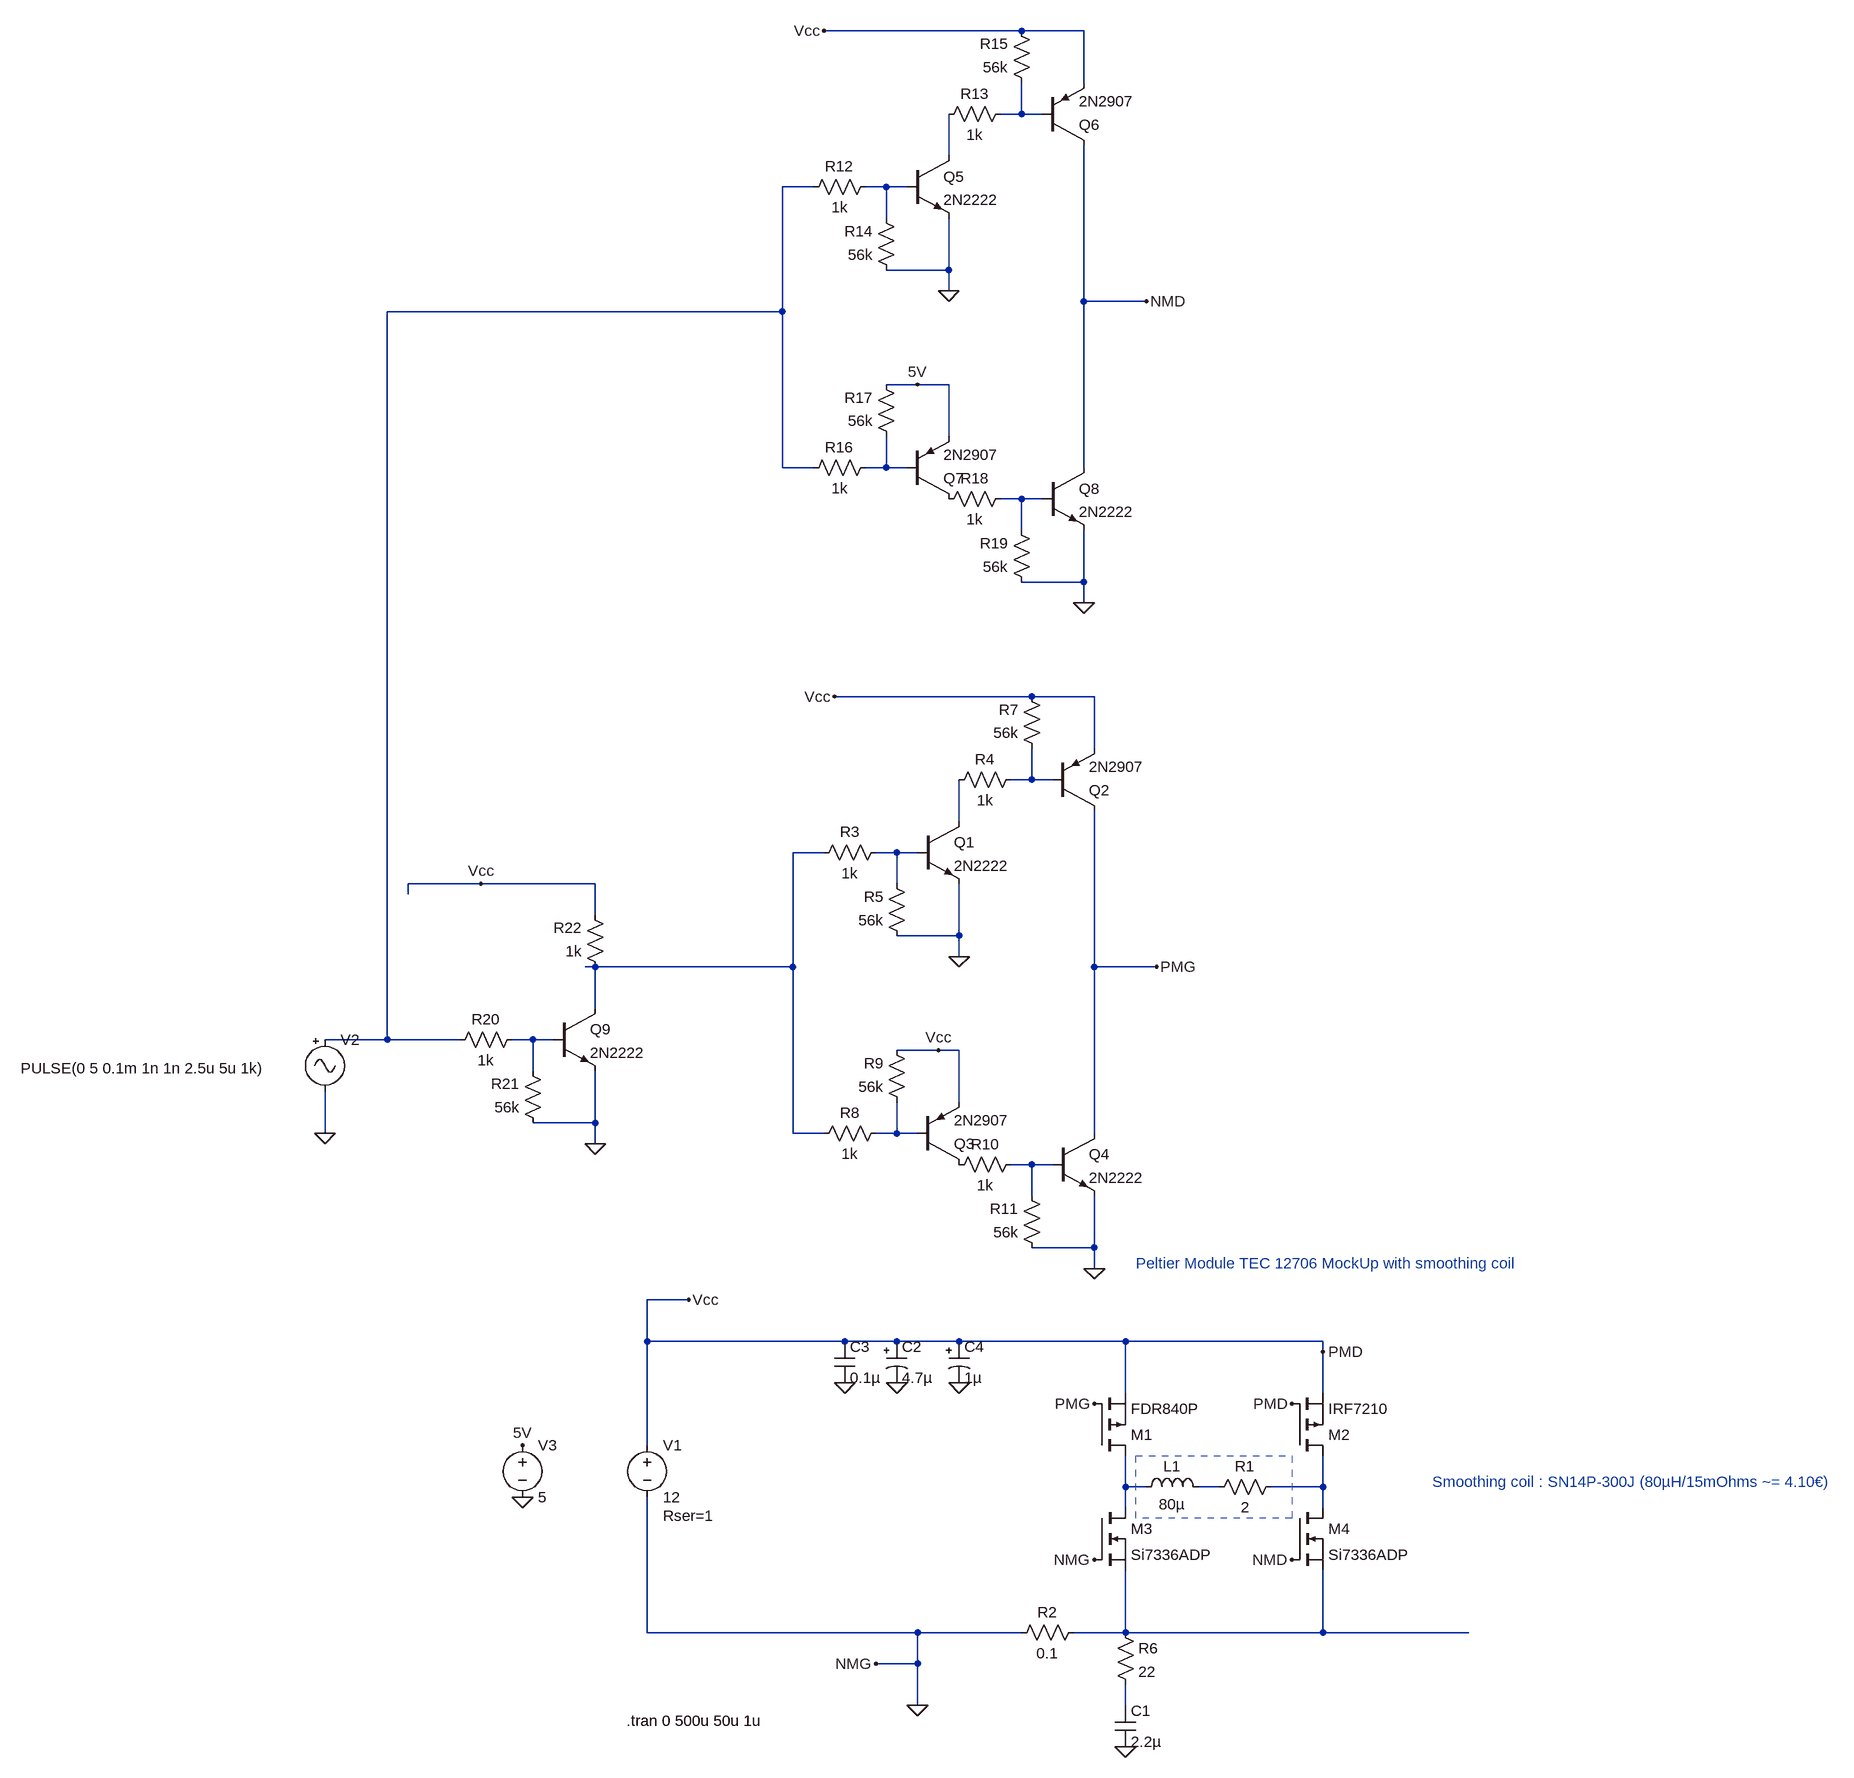
[diagram p0: schematic HBridge_SmoothPeltierModules.asc]
HBridge_SmoothPeltierModules.asc, the LTspice schematic file:
Version 4
SHEET 1 1244 680
WIRE -64 -2032 -368 -2032
WIRE 32 -2032 -64 -2032
WIRE 32 -1952 32 -2032
WIRE -64 -1904 -64 -1952
WIRE -64 -1904 -96 -1904
WIRE -32 -1904 -64 -1904
WIRE -176 -1840 -176 -1904
WIRE -384 -1792 -432 -1792
WIRE -272 -1792 -304 -1792
WIRE -240 -1792 -272 -1792
WIRE -272 -1744 -272 -1792
WIRE -176 -1664 -176 -1744
WIRE -176 -1664 -272 -1664
WIRE -176 -1632 -176 -1664
WIRE 32 -1616 32 -1856
WIRE 128 -1616 32 -1616
WIRE -432 -1600 -432 -1792
WIRE -432 -1600 -1040 -1600
WIRE -224 -1488 -272 -1488
WIRE -176 -1488 -224 -1488
WIRE -176 -1408 -176 -1488
WIRE -432 -1360 -432 -1600
WIRE -384 -1360 -432 -1360
WIRE -272 -1360 -272 -1408
WIRE -272 -1360 -304 -1360
WIRE -240 -1360 -272 -1360
WIRE 32 -1360 32 -1616
WIRE -64 -1312 -96 -1312
WIRE -32 -1312 -64 -1312
WIRE -64 -1264 -64 -1312
WIRE 32 -1184 32 -1264
WIRE 32 -1184 -64 -1184
WIRE 32 -1152 32 -1184
WIRE -48 -1008 -352 -1008
WIRE 48 -1008 -48 -1008
WIRE 48 -928 48 -1008
WIRE -48 -880 -48 -928
WIRE -48 -880 -80 -880
WIRE -16 -880 -48 -880
WIRE -160 -816 -160 -880
WIRE -368 -768 -416 -768
WIRE -256 -768 -288 -768
WIRE -224 -768 -256 -768
WIRE -896 -720 -1008 -720
WIRE -720 -720 -896 -720
WIRE -256 -720 -256 -768
WIRE -1008 -704 -1008 -720
WIRE -720 -672 -720 -720
WIRE -160 -640 -160 -720
WIRE -160 -640 -256 -640
WIRE -160 -608 -160 -640
WIRE -720 -592 -736 -592
WIRE -416 -592 -416 -768
WIRE -416 -592 -720 -592
WIRE 48 -592 48 -832
WIRE 144 -592 48 -592
WIRE -720 -528 -720 -592
WIRE -1040 -480 -1040 -1600
WIRE -1040 -480 -1136 -480
WIRE -928 -480 -1040 -480
WIRE -816 -480 -848 -480
WIRE -784 -480 -816 -480
WIRE -192 -464 -256 -464
WIRE -160 -464 -192 -464
WIRE -816 -432 -816 -480
WIRE -160 -384 -160 -464
WIRE -720 -352 -720 -432
WIRE -720 -352 -816 -352
WIRE -1136 -336 -1136 -400
WIRE -416 -336 -416 -592
WIRE -368 -336 -416 -336
WIRE -256 -336 -256 -384
WIRE -256 -336 -288 -336
WIRE -224 -336 -256 -336
WIRE 48 -336 48 -592
WIRE -720 -320 -720 -352
WIRE -48 -288 -80 -288
WIRE -16 -288 -48 -288
WIRE -48 -240 -48 -288
WIRE 48 -160 48 -240
WIRE 48 -160 -48 -160
WIRE 48 -128 48 -160
WIRE -576 -80 -640 -80
WIRE -640 -16 -640 -80
WIRE -336 -16 -640 -16
WIRE -256 -16 -336 -16
WIRE -160 -16 -256 -16
WIRE 96 -16 -160 -16
WIRE 400 -16 96 -16
WIRE 400 0 400 -16
WIRE 96 64 96 -16
WIRE 400 64 400 0
WIRE -640 144 -640 -16
WIRE 96 208 96 160
WIRE 128 208 96 208
WIRE 240 208 208 208
WIRE 400 208 400 160
WIRE 400 208 320 208
WIRE 96 240 96 208
WIRE 400 240 400 208
WIRE -640 432 -640 224
WIRE -224 432 -640 432
WIRE -64 432 -224 432
WIRE 96 432 96 336
WIRE 96 432 16 432
WIRE 400 432 400 336
WIRE 400 432 96 432
WIRE 624 432 400 432
WIRE -224 480 -224 432
WIRE -224 480 -288 480
WIRE -224 544 -224 480
WIRE 96 544 96 512
FLAG 48 80 PMG
FLAG 48 320 NMG
FLAG 352 320 NMD
FLAG 352 80 PMD
FLAG -224 544 0
FLAG -288 480 NMG
FLAG 400 0 PMD
FLAG -160 -608 0
FLAG -576 -80 Vcc
FLAG -352 -1008 Vcc
FLAG -1136 -336 0
FLAG 96 608 0
FLAG 144 -592 PMG
FLAG 48 -128 0
FLAG -832 224 0
FLAG -832 144 5V
FLAG -176 -1632 0
FLAG -368 -2032 Vcc
FLAG 32 -1152 0
FLAG -224 -1488 5V
FLAG -192 -464 Vcc
FLAG -720 -320 0
FLAG -896 -720 Vcc
FLAG 128 -1616 NMD
FLAG -256 48 0
FLAG -336 48 0
FLAG -160 48 0
SYMBOL pmos 48 160 M180
SYMATTR InstName M1
SYMATTR Value FDR840P
SYMBOL pmos 352 160 M180
SYMATTR InstName M2
SYMATTR Value IRF7210
SYMBOL nmos 48 240 R0
SYMATTR InstName M3
SYMATTR Value Si7336ADP
SYMBOL nmos 352 240 R0
SYMATTR InstName M4
SYMATTR Value Si7336ADP
SYMBOL ind 112 224 R270
WINDOW 0 32 56 VTop 2
WINDOW 3 5 56 VBottom 2
SYMATTR InstName L1
SYMATTR Value 80µ
SYMATTR SpiceLine Ipk=15 Rser=0.015 Cpar=0
SYMBOL res 336 192 R90
WINDOW 0 0 56 VBottom 2
WINDOW 3 32 56 VTop 2
SYMATTR InstName R1
SYMATTR Value 2
SYMBOL res 32 416 R90
WINDOW 0 0 56 VBottom 2
WINDOW 3 32 56 VTop 2
SYMATTR InstName R2
SYMATTR Value 0.1
SYMBOL voltage -640 128 R0
WINDOW 123 0 0 Left 0
WINDOW 39 24 124 Left 2
SYMATTR SpiceLine Rser=1
SYMATTR InstName V1
SYMATTR Value 12
SYMBOL npn -224 -816 R0
SYMATTR InstName Q1
SYMATTR Value 2N2222
SYMBOL res -272 -784 R90
WINDOW 0 0 56 VBottom 2
WINDOW 3 32 56 VTop 2
SYMATTR InstName R3
SYMATTR Value 1k
SYMBOL res -64 -896 R90
WINDOW 0 0 56 VBottom 2
WINDOW 3 32 56 VTop 2
SYMATTR InstName R4
SYMATTR Value 1k
SYMBOL Misc\\signal -1136 -496 R0
WINDOW 123 0 0 Left 0
WINDOW 39 0 0 Left 0
WINDOW 3 -468 60 Left 2
SYMATTR Value PULSE(0 5 0.1m 1n 1n 2.5u 5u 1k)
SYMATTR InstName V2
SYMBOL res -240 -624 R180
WINDOW 0 36 76 Left 2
WINDOW 3 36 40 Left 2
SYMATTR InstName R5
SYMATTR Value 56k
SYMBOL cap 80 544 R0
SYMATTR InstName C1
SYMATTR Value 2.2µ
SYMBOL res 80 416 R0
SYMATTR InstName R6
SYMATTR Value 22
SYMBOL pnp -16 -832 M180
SYMATTR InstName Q2
SYMATTR Value 2N2907
SYMBOL res -32 -912 R180
WINDOW 0 36 76 Left 2
WINDOW 3 36 40 Left 2
SYMATTR InstName R7
SYMATTR Value 56k
SYMBOL res -272 -352 R90
WINDOW 0 0 56 VBottom 2
WINDOW 3 32 56 VTop 2
SYMATTR InstName R8
SYMATTR Value 1k
SYMBOL pnp -224 -288 M180
SYMATTR InstName Q3
SYMATTR Value 2N2907
SYMBOL res -240 -368 R180
WINDOW 0 36 76 Left 2
WINDOW 3 36 40 Left 2
SYMATTR InstName R9
SYMATTR Value 56k
SYMBOL npn -16 -336 R0
SYMATTR InstName Q4
SYMATTR Value 2N2222
SYMBOL res -64 -304 R90
WINDOW 0 0 56 VBottom 2
WINDOW 3 32 56 VTop 2
SYMATTR InstName R10
SYMATTR Value 1k
SYMBOL res -32 -144 R180
WINDOW 0 36 76 Left 2
WINDOW 3 36 40 Left 2
SYMATTR InstName R11
SYMATTR Value 56k
SYMBOL voltage -832 128 R0
WINDOW 123 0 0 Left 0
WINDOW 39 0 0 Left 0
SYMATTR InstName V3
SYMATTR Value 5
SYMBOL npn -240 -1840 R0
SYMATTR InstName Q5
SYMATTR Value 2N2222
SYMBOL res -288 -1808 R90
WINDOW 0 0 56 VBottom 2
WINDOW 3 32 56 VTop 2
SYMATTR InstName R12
SYMATTR Value 1k
SYMBOL res -80 -1920 R90
WINDOW 0 0 56 VBottom 2
WINDOW 3 32 56 VTop 2
SYMATTR InstName R13
SYMATTR Value 1k
SYMBOL res -256 -1648 R180
WINDOW 0 36 76 Left 2
WINDOW 3 36 40 Left 2
SYMATTR InstName R14
SYMATTR Value 56k
SYMBOL pnp -32 -1856 M180
SYMATTR InstName Q6
SYMATTR Value 2N2907
SYMBOL res -48 -1936 R180
WINDOW 0 36 76 Left 2
WINDOW 3 36 40 Left 2
SYMATTR InstName R15
SYMATTR Value 56k
SYMBOL res -288 -1376 R90
WINDOW 0 0 56 VBottom 2
WINDOW 3 32 56 VTop 2
SYMATTR InstName R16
SYMATTR Value 1k
SYMBOL pnp -240 -1312 M180
SYMATTR InstName Q7
SYMATTR Value 2N2907
SYMBOL res -256 -1392 R180
WINDOW 0 36 76 Left 2
WINDOW 3 36 40 Left 2
SYMATTR InstName R17
SYMATTR Value 56k
SYMBOL npn -32 -1360 R0
SYMATTR InstName Q8
SYMATTR Value 2N2222
SYMBOL res -80 -1328 R90
WINDOW 0 0 56 VBottom 2
WINDOW 3 32 56 VTop 2
SYMATTR InstName R18
SYMATTR Value 1k
SYMBOL res -48 -1168 R180
WINDOW 0 36 76 Left 2
WINDOW 3 36 40 Left 2
SYMATTR InstName R19
SYMATTR Value 56k
SYMBOL npn -784 -528 R0
SYMATTR InstName Q9
SYMATTR Value 2N2222
SYMBOL res -832 -496 R90
WINDOW 0 0 56 VBottom 2
WINDOW 3 32 56 VTop 2
SYMATTR InstName R20
SYMATTR Value 1k
SYMBOL res -800 -336 R180
WINDOW 0 36 76 Left 2
WINDOW 3 36 40 Left 2
SYMATTR InstName R21
SYMATTR Value 56k
SYMBOL res -704 -576 R180
WINDOW 0 36 76 Left 2
WINDOW 3 36 40 Left 2
SYMATTR InstName R22
SYMATTR Value 1k
SYMBOL polcap -272 -16 R0
WINDOW 3 24 56 Left 2
SYMATTR InstName C2
SYMATTR Value 4.7µ
SYMATTR Description Capacitor
SYMATTR Type cap
SYMATTR SpiceLine V=25 Irms=24m Rser=5 Lser=0 mfg="Nichicon" pn="UPR1E4R7MAH" type="Al electrolytic"
SYMBOL cap -352 -16 R0
SYMATTR InstName C3
SYMATTR Value 0.1µ
SYMATTR SpiceLine V=25 Irms=2.1 Rser=0.0606238 Lser=0 mfg="KEMET" pn="C1210C104K3RAC" type="X7R"
SYMBOL polcap -176 -16 R0
WINDOW 3 24 56 Left 2
SYMATTR InstName C4
SYMATTR Value 1µ
SYMATTR Description Capacitor
SYMATTR Type cap
SYMATTR SpiceLine V=50 Irms=36m Rser=3.5 Lser=0 mfg="Nichicon" pn="UPL1H010MAH" type="Al electrolytic"
TEXT -672 568 Left 2 !.tran 0 500u 50u 1u
TEXT 112 -136 Left 2 ;Peltier Module TEC 12706 MockUp with smoothing coil
TEXT 568 200 Left 2 ;Smoothing coil : SN14P-300J (80µH/15mOhms ~= 4.10€)
RECTANGLE Normal 352 256 112 160 2

The netlist it stands for:
* HBridge_SmoothPeltierModules.asc
M1 N014 PMG Vcc Vcc FDR840P
M2 N016 Vcc Vcc Vcc IRF7210
M3 N014 0 N017 N017 Si7336ADP
M4 N016 NMD N017 N017 Si7336ADP
L1 N014 N015 80µ Ipk=15 Rser=0.015 Cpar=0
R1 N016 N015 2
R2 N017 0 0.1
V1 Vcc 0 12 Rser=1
Q1 N008 N010 0 0 2N2222
R3 N010 N009 1k
R4 N007 N008 1k
V2 N003 0 PULSE(0 5 0.1m 1n 1n 2.5u 5u 1k)
R5 0 N010 56k
C1 N018 0 2.2µ
R6 N017 N018 22
Q2 PMG N007 Vcc 0 2N2907
R7 N007 Vcc 56k
R8 N012 N009 1k
Q3 P001 N012 Vcc 0 2N2907
R9 N012 Vcc 56k
Q4 PMG N013 0 0 2N2222
R10 N013 P001 1k
R11 0 N013 56k
V3 5V 0 5
Q5 N002 N004 0 0 2N2222
R12 N004 N003 1k
R13 N001 N002 1k
R14 0 N004 56k
Q6 NMD N001 Vcc 0 2N2907
R15 N001 Vcc 56k
R16 N005 N003 1k
Q7 P002 N005 5V 0 2N2907
R17 N005 5V 56k
Q8 NMD N006 0 0 2N2222
R18 N006 P002 1k
R19 0 N006 56k
Q9 N009 N011 0 0 2N2222
R20 N011 N003 1k
R21 0 N011 56k
R22 N009 Vcc 1k
C2 Vcc 0 4.7µ V=25 Irms=24m Rser=5 Lser=0 mfg="Nichicon" pn="UPR1E4R7MAH" type="Al electrolytic"
C3 Vcc 0 0.1µ V=25 Irms=2.1 Rser=0.0606238 Lser=0 mfg="KEMET" pn="C1210C104K3RAC" type="X7R"
C4 Vcc 0 1µ V=50 Irms=36m Rser=3.5 Lser=0 mfg="Nichicon" pn="UPL1H010MAH" type="Al electrolytic"
.model NPN NPN
.model PNP PNP
.lib standard.bjt
.model NMOS NMOS
.model PMOS PMOS
.lib standard.mos
.tran 0 500u 50u 1u
* Peltier Module TEC 12706 MockUp with smoothing coil
* Smoothing coil : SN14P-300J (80µH/15mOhms ~= 4.10€)
.backanno
.end